# Altium project Template.PrjPCB
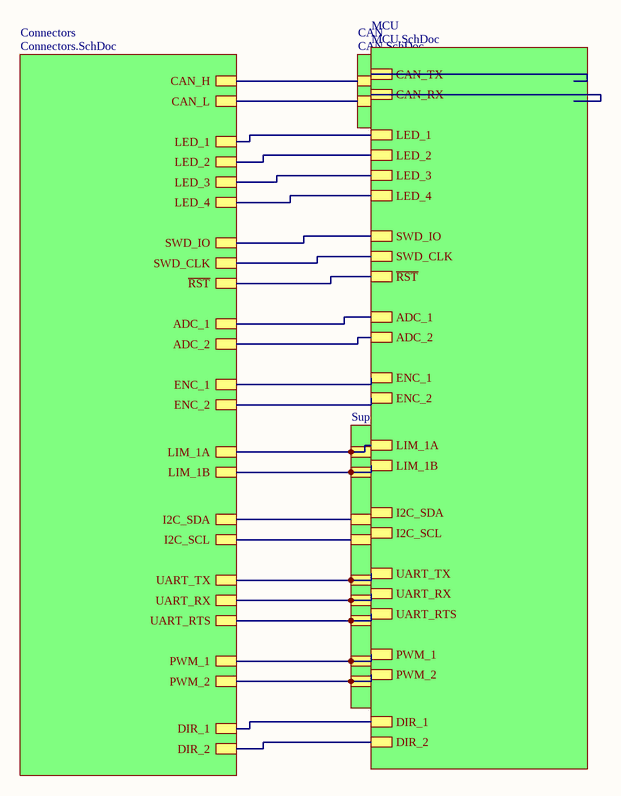
[diagram p0: Template.SchDoc]
3 sheets, 22 parts. Net scope: hierarchical (ports join the sheet entries above them; power ports are global).
Sheets:
  Template.SchDoc
    CAN = CAN.SchDoc
    MCU = MCU.SchDoc

## Sheet Template.SchDoc
size A4

### Sub-sheets
CAN = CAN.SchDoc: CAN_H, CAN_L, CAN_TX, CAN_RX
Connectors = Connectors.SchDoc (file not in this document): CAN_H, CAN_L, LED_1, LED_2, LED_3, LED_4, SWD_IO, SWD_CLK, ~{RST}, ADC_1, ADC_2, ENC_1, ENC_2, LIM_1A, LIM_1B, I2C_SDA, I2C_SCL, UART_TX, UART_RX, UART_RTS, PWM_1, DIR_2, DIR_1, PWM_2
MCU = MCU.SchDoc: CAN_TX, CAN_RX, LED_1, LED_2, LED_3, LED_4, SWD_IO, SWD_CLK, ~{RST}, ADC_1, ADC_2, ENC_1, ENC_2, LIM_1A, LIM_1B, I2C_SDA, I2C_SCL, UART_TX, UART_RX, UART_RTS, PWM_1, DIR_2, DIR_1, PWM_2
Support = Support.SchDoc (file not in this document): LIM_1A, LIM_1B, I2C_SDA, I2C_SCL, UART_TX, UART_RX, UART_RTS, PWM_1, PWM_2

### Nets
CAN_H: sheet Connectors/CAN_H, sheet CAN/CAN_H
CAN_L: sheet Connectors/CAN_L, sheet CAN/CAN_L
~{RST}: sheet Connectors/~{RST}, sheet MCU/~{RST}
NetU?#1_1: sheet CAN/CAN_TX, sheet MCU/CAN_TX
NetU?#1_4: sheet CAN/CAN_RX, sheet MCU/CAN_RX
NetU?#2_8: sheet Connectors/LED_1, sheet MCU/LED_1
NetU?#2_9: sheet Connectors/LED_2, sheet MCU/LED_2
NetU?#2_10: sheet Connectors/LED_3, sheet MCU/LED_3
NetU?#2_11: sheet Connectors/LED_4, sheet MCU/LED_4
NetU?#2_20: sheet Connectors/ADC_1, sheet MCU/ADC_1
NetU?#2_21: sheet Connectors/ADC_2, sheet MCU/ADC_2
NetU?#2_26: sheet Connectors/ENC_1, sheet MCU/ENC_1
NetU?#2_27: sheet Connectors/ENC_2, sheet MCU/ENC_2
NetU?#2_29: sheet Connectors/LIM_1A, sheet Support/LIM_1A, sheet MCU/LIM_1A
NetU?#2_30: sheet Connectors/LIM_1B, sheet Support/LIM_1B, sheet MCU/LIM_1B
NetU?#2_34: sheet Connectors/PWM_1, sheet Support/PWM_1, sheet MCU/PWM_1
NetU?#2_35: sheet Connectors/DIR_1, sheet MCU/DIR_1
NetU?#2_36: sheet Connectors/PWM_2, sheet Support/PWM_2, sheet MCU/PWM_2
NetU?#2_37: sheet Connectors/DIR_2, sheet MCU/DIR_2
NetU?#2_46: sheet Connectors/SWD_IO, sheet MCU/SWD_IO
NetU?#2_49: sheet Connectors/SWD_CLK, sheet MCU/SWD_CLK
NetU?#2_51: sheet Connectors/UART_TX, sheet Support/UART_TX, sheet MCU/UART_TX
NetU?#2_52: sheet Connectors/UART_RX, sheet Support/UART_RX, sheet MCU/UART_RX
NetU?#2_54: sheet Connectors/UART_RTS, sheet Support/UART_RTS, sheet MCU/UART_RTS
(unnamed): sheet Connectors/I2C_SDA, sheet Support/I2C_SDA
(unnamed): sheet Connectors/I2C_SCL, sheet Support/I2C_SCL

## Sheet CAN.SchDoc
size A4
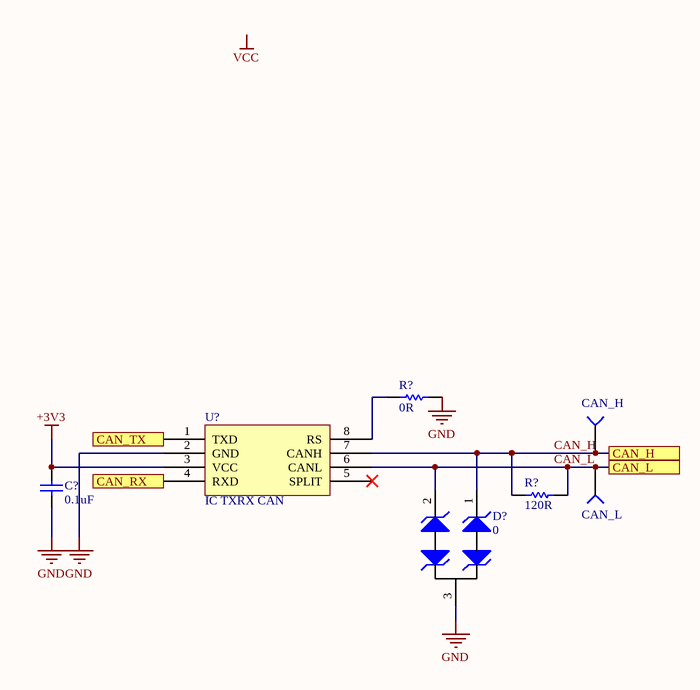
[diagram p1: CAN.SchDoc]

### Parts
(Parts that share a designator on the sheet are numbered #1, #2 ... from top to bottom, then left to right.)
C?#1  value 0.1uF  [CAPC0603(1608)55_N]  (hidden comment: CAP_0.1uF_16V_0603)
D?  0
R?#1  value 0R  [RESC0201(0603)_N]  (hidden comment: RES_0R_0603)
R?#2  value 120R  [RESC0201(0603)_N]  (hidden comment: RES_120R_0603)
TP?#1  CAN_H  [TESTPOINT]
TP?#2  CAN_L  [TESTPOINT]
U?#1  IC TXRX CAN

### Ports
CAN_H, CAN_L, CAN_RX, CAN_TX

### Nets
+3V3: C?#1.2 U?#1.3(VCC)
GND: C?#1.1 D?.3 R?#1.2 U?#1.2(GND)
CAN_H: D?.1 R?#2.1 TP?#1.1(=value) U?#1.7(CANH) ; port CAN_H
CAN_L: D?.2 R?#2.2 TP?#2.1(=value) U?#1.6(CANL) ; port CAN_L
NetR?#1_1: R?#1.1 U?#1.8(RS)
NetU?#1_1: U?#1.1(TXD) ; port CAN_TX
NetU?#1_4: U?#1.4(RXD) ; port CAN_RX

Not connected (* = marked no-connect by the designer): U?#1 5(SPLIT)*

### Notes on the sheet
- Labels drawn without touching a wire or pin: VCC

### Library data of the parts
C?#1 = CAP_0.1uF_16V_0603: CAP CER 0.1UF 16V X7R 0603; Part Number: CC0603KRX7R7BB104; Manufacturer: Yageo; Dimensions: 0.063" L x 0.031" W (1.60mm x 0.80mm); Package: 0603 (1608 Metric); Temperature Coefficient: X7R; Voltage Rating: 16V
D? = TVS_DIODE_CAN: TVS DIODE 24V 50V SOT323-3; Part Number: PESD1CAN-UX; Manufacturer: Nexperia USA Inc.; Package: SC-70, SOT-323; ComponentLink1Description: Datasheet; ComponentLink1URL: https://assets.nexperia.com/documents/data-sheet/PESD1CAN-U.pdf
R?#1 = RES_0R_0603: RES SMD 0 OHM JUMPER 1/10W 0603; Manufacturer: Yageo; Part Number (MPN): RC0603JR-070RL; Package: 0603 (1608 Metric); Dimensions: 0.063" L x 0.031" W (1.60mm x 0.80mm)
R?#2 = RES_120R_0603: RES SMD 120 OHM 5% 1/10W 0603; Manufacturer: Yageo; Part Number (MPN): RC0603JR-07120RL; Package: 0603 (1608 Metric); Dimensions: 0.063" L x 0.031" W (1.60mm x 0.80mm); Tolerance: 5%
TP?#1 TP?#2 = TESTPOINT_SMD
U?#1 = LTC2875: IC TXRX CAN 4MBPS 8SO; Manufacturer: Linear Technologies; Part Number: LTC2875IS8#PBF; Package: 8-SOIC (0.154", 3.90mm Width); ComponentLink1Description: Datasheet; ComponentLink1URL: https://www.analog.com/media/en/technical-documentation/data-sheets/2875f.pdf

## Sheet MCU.SchDoc
size A4
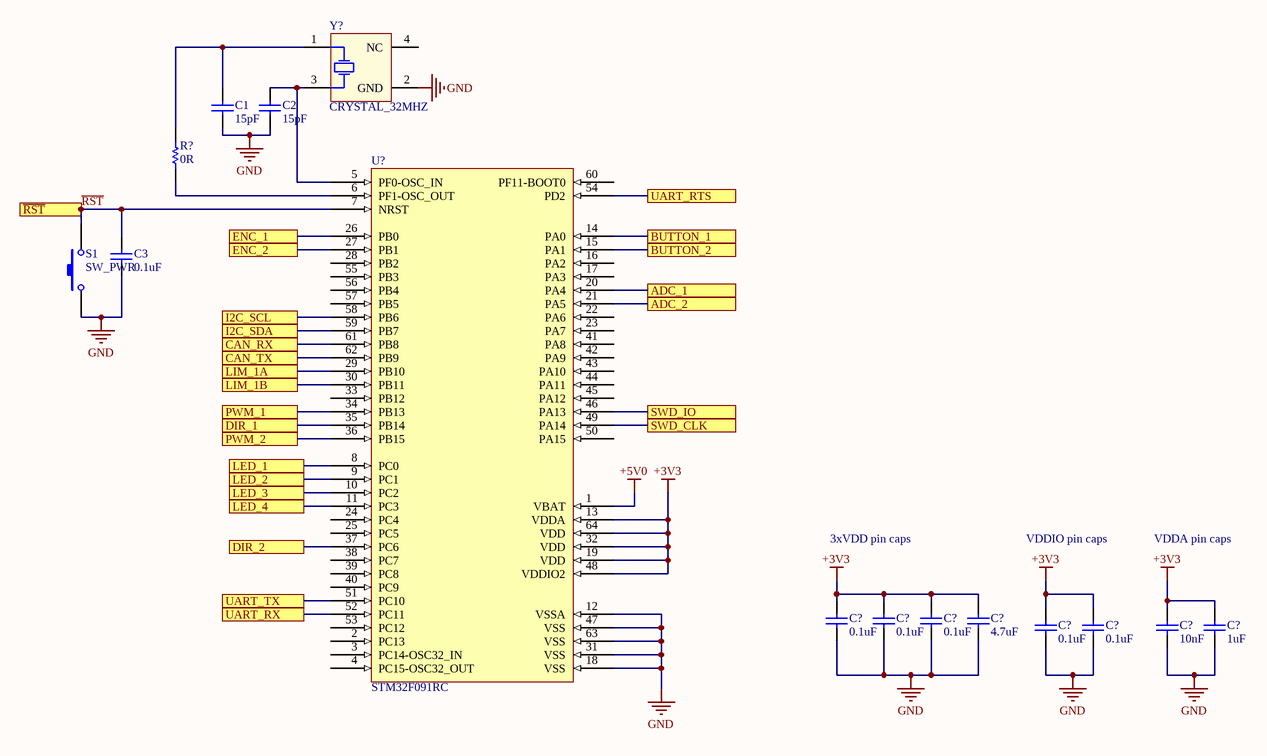
[diagram p2: MCU.SchDoc]

### Parts
(Parts that share a designator on the sheet are numbered #1, #2 ... from top to bottom, then left to right.)
C1  value 15pF  [CAPC0603(1608)55_N]  (hidden comment: CAP_15pF_0603)
C2  value 15pF  [CAPC0603(1608)55_N]  (hidden comment: CAP_15pF_0603)
C3  value 0.1uF  [CAPC0603(1608)55_N]  (hidden comment: CAP_0.1uF_16V_0603)
C?#2  value 0.1uF  [CAPC0603(1608)55_N]  (hidden comment: CAP_0.1uF_16V_0603)
C?#3  value 0.1uF  [CAPC0603(1608)55_N]  (hidden comment: CAP_0.1uF_16V_0603)
C?#4  value 0.1uF  [CAPC0603(1608)55_N]  (hidden comment: CAP_0.1uF_16V_0603)
C?#5  value 4.7uF  [CAPC0603(1608)55_N]  (hidden comment: CAP_4.7uF_0603)
C?#6  value 0.1uF  [CAPC0603(1608)55_N]  (hidden comment: CAP_0.1uF_16V_0603)
C?#7  value 0.1uF  [CAPC0603(1608)55_N]  (hidden comment: CAP_0.1uF_16V_0603)
C?#8  value 10nF  [CAPC0603(1608)55_N]  (hidden comment: CAP_10nF_0603)
C?#9  value 1uF  [CAPC0603(1608)55_N]  (hidden comment: CAP_1uF_16V_0603)
R?#3  value 0R  [RESC0201(0603)_N]  (hidden comment: RES_0R_0603)
S1  SW_PWR  [SPST-2]
U?#2  STM32F091RC  [STM-LQFP64_M]
Y?  CRYSTAL_32MHZ  [AVX-CX2520DB32000D0GEJZ1-4_V]

### Ports
ADC_1, ADC_2, BUTTON_1, BUTTON_2, CAN_RX, CAN_TX, DIR_1, DIR_2, ENC_1, ENC_2, I2C_SCL, I2C_SDA, LED_1, LED_2, LED_3, LED_4, LIM_1A, LIM_1B, PWM_1, PWM_2, SWD_CLK, SWD_IO, UART_RTS, UART_RX, UART_TX, ~{RST} (in)

### Nets
+3V3: C?#2.2 C?#3.2 C?#4.2 C?#5.2 C?#6.2 C?#7.2 C?#8.2 C?#9.2 U?#2.13(VDDA) U?#2.19(VDD) U?#2.32(VDD) U?#2.48(VDDIO2) U?#2.64(VDD)
+5V0: U?#2.1(VBAT)
GND: C1.1 C2.1 C3.1 C?#2.1 C?#3.1 C?#4.1 C?#5.1 C?#6.1 C?#7.1 C?#8.1 C?#9.1 S1.1 U?#2.12(VSSA) U?#2.18(VSS) U?#2.31(VSS) U?#2.47(VSS) U?#2.63(VSS) Y?.2(GND)
~{RST}: C3.2 S1.2 U?#2.7(NRST) ; port ~{RST}
NetC1_2: C1.2 R?#3.2 Y?.1(HOT)
NetC2_2: C2.2 U?#2.5(PF0-OSC_IN) Y?.3(HOT)
NetR?#3_1: R?#3.1 U?#2.6(PF1-OSC_OUT)
NetU?#1_1: U?#2.62(PB9) ; port CAN_TX
NetU?#1_4: U?#2.61(PB8) ; port CAN_RX
NetU?#2_8: U?#2.8(PC0) ; port LED_1
NetU?#2_9: U?#2.9(PC1) ; port LED_2
NetU?#2_10: U?#2.10(PC2) ; port LED_3
NetU?#2_11: U?#2.11(PC3) ; port LED_4
NetU?#2_14: U?#2.14(PA0) ; port BUTTON_1
NetU?#2_15: U?#2.15(PA1) ; port BUTTON_2
NetU?#2_20: U?#2.20(PA4) ; port ADC_1
NetU?#2_21: U?#2.21(PA5) ; port ADC_2
NetU?#2_26: U?#2.26(PB0) ; port ENC_1
NetU?#2_27: U?#2.27(PB1) ; port ENC_2
NetU?#2_29: U?#2.29(PB10) ; port LIM_1A
NetU?#2_30: U?#2.30(PB11) ; port LIM_1B
NetU?#2_34: U?#2.34(PB13) ; port PWM_1
NetU?#2_35: U?#2.35(PB14) ; port DIR_1
NetU?#2_36: U?#2.36(PB15) ; port PWM_2
NetU?#2_37: U?#2.37(PC6) ; port DIR_2
NetU?#2_46: U?#2.46(PA13) ; port SWD_IO
NetU?#2_49: U?#2.49(PA14) ; port SWD_CLK
NetU?#2_51: U?#2.51(PC10) ; port UART_TX
NetU?#2_52: U?#2.52(PC11) ; port UART_RX
NetU?#2_54: U?#2.54(PD2) ; port UART_RTS
NetU?#2_58: U?#2.58(PB6) ; port I2C_SCL
NetU?#2_59: U?#2.59(PB7) ; port I2C_SDA

Not connected (* = marked no-connect by the designer): U?#2 2(PC13) 3(PC14-OSC32_IN) 4(PC15-OSC32_OUT) 16(PA2) 17(PA3) 22(PA6) 23(PA7) 24(PC4) 25(PC5) 28(PB2) 33(PB12) 38(PC7) 39(PC8) 40(PC9) 41(PA8) 42(PA9) 43(PA10) 44(PA11) 45(PA12) 50(PA15) 53(PC12) 55(PB3) 56(PB4) 57(PB5) 60(PF11-BOOT0); Y? 4(NC)

### Notes on the sheet
- 3xVDD pin caps
- VDDIO pin caps
- VDDA pin caps

### Library data of the parts
C1 C2 = CAP_15pF_0603: CAP CER 15PF 250V NPO 0603; Part Number: AC0603JRNPOYBN150; Manufacturer: Yageo; Temperature Coefficient: NP0; Dimensions: 0.063" L x 0.031" W (1.60mm x 0.80mm); Package: 0603 (1608 Metric); Voltage Rating: 250v
C3 C?#2-C?#4 C?#6 C?#7 = CAP_0.1uF_16V_0603: as C?#1 on sheet CAN; Dimensions: 0.063" L x 0.031" W (1.60mm x 0.80mm); Package: 0603 (1608 Metric); Temperature Coefficient: X7R; Voltage Rating: 16V
C?#5 = CAP_4.7uF_0603: CAP CER 4.7UF 6.3V X5R 0603; Part Number: CC0603KRX5R5BB475; Manufacturer: Yageo; Dimensions: 0.063" L x 0.031" W (1.60mm x 0.80mm); Package: 0603 (1608 Metric); Temperature Coefficient: X5R; Voltage Rating: 6.3V
C?#8 = CAP_10nF_0603: CAP CER 10000PF 16V X7R 0603; Part Number: CC0603KRX7R7BB103; Manufacturer: Yageo; Dimensions: 0.063" L x 0.031" W (1.60mm x 0.80mm); Package: 0603 (1608 Metric); Temperature Coefficient: X7R; Voltage Rating: 16V
C?#9 = CAP_1uF_16V_0603: CAP CER 1UF 16V Y5V 0603; Part Number: CC0603ZRY5V7BB105; Manufacturer: Yageo; Dimensions: 0.063" L x 0.031" W (1.60mm x 0.80mm); Package: 0603 (1608 Metric); Temperature Coefficient: Y5V; Voltage Rating: 16V
R?#3 = RES_0R_0603: as R?#1 on sheet CAN; Package: 0603 (1608 Metric); Dimensions: 0.063" L x 0.031" W (1.60mm x 0.80mm)
S1 = SW_PWR: Switch; Published: 24-Mar-1999; LatestRevisionDate: 17-Jul-2002; LatestRevisionNote: Re-released for DXP Platform.; PackageReference: SPST-2; Publisher: Altium Limited; PackageDescription: Switch; 2 Leads
U?#2 = STM32F091RC: Manufacturer: STMicroelectronics; Part Number: STM32F091RC; Package: 64-LQFP; ComponentLink1Description: Datasheet; ComponentLink1URL: https://www.st.com/content/ccc/resource/technical/document/datasheet/95/3c/2e/5b/21/09/45/a6/DM00115237.pdf/files/DM00115237.pdf/jcr:content/translations/en.DM00115237.pdf#%5B%7B%22num%22%3A96%2C%22gen%22%3A0%7D%2C%7B%22name%22%3A%22XYZ%22%7D%2C67%2C755%2Cnull%5D
Y? = CRYSTAL_32MHZ: CRYSTAL 32MHZ 8PF SMD; Part Number: CX2520DB32000D0GPSC1; Manufacturer: Kyocera International Inc. Electronic Components; Package: 4-SMD, No Lead; Dimensions: 0.098" L x 0.079" W (2.50mm x 2.00mm)

## Nets that join several sheets
+3V3: CAN (C?#1.2 U?#1.3), MCU (13 pins)
GND: CAN (C?#1.1 D?.3 R?#1.2 U?#1.2), MCU (18 pins)
NetU?#1_1: CAN (U?#1.1), MCU (U?#2.62)
NetU?#1_4: CAN (U?#1.4), MCU (U?#2.61)